# EAGLE design DuinoMite-Mini_Rev_C (EAGLE 4.16)
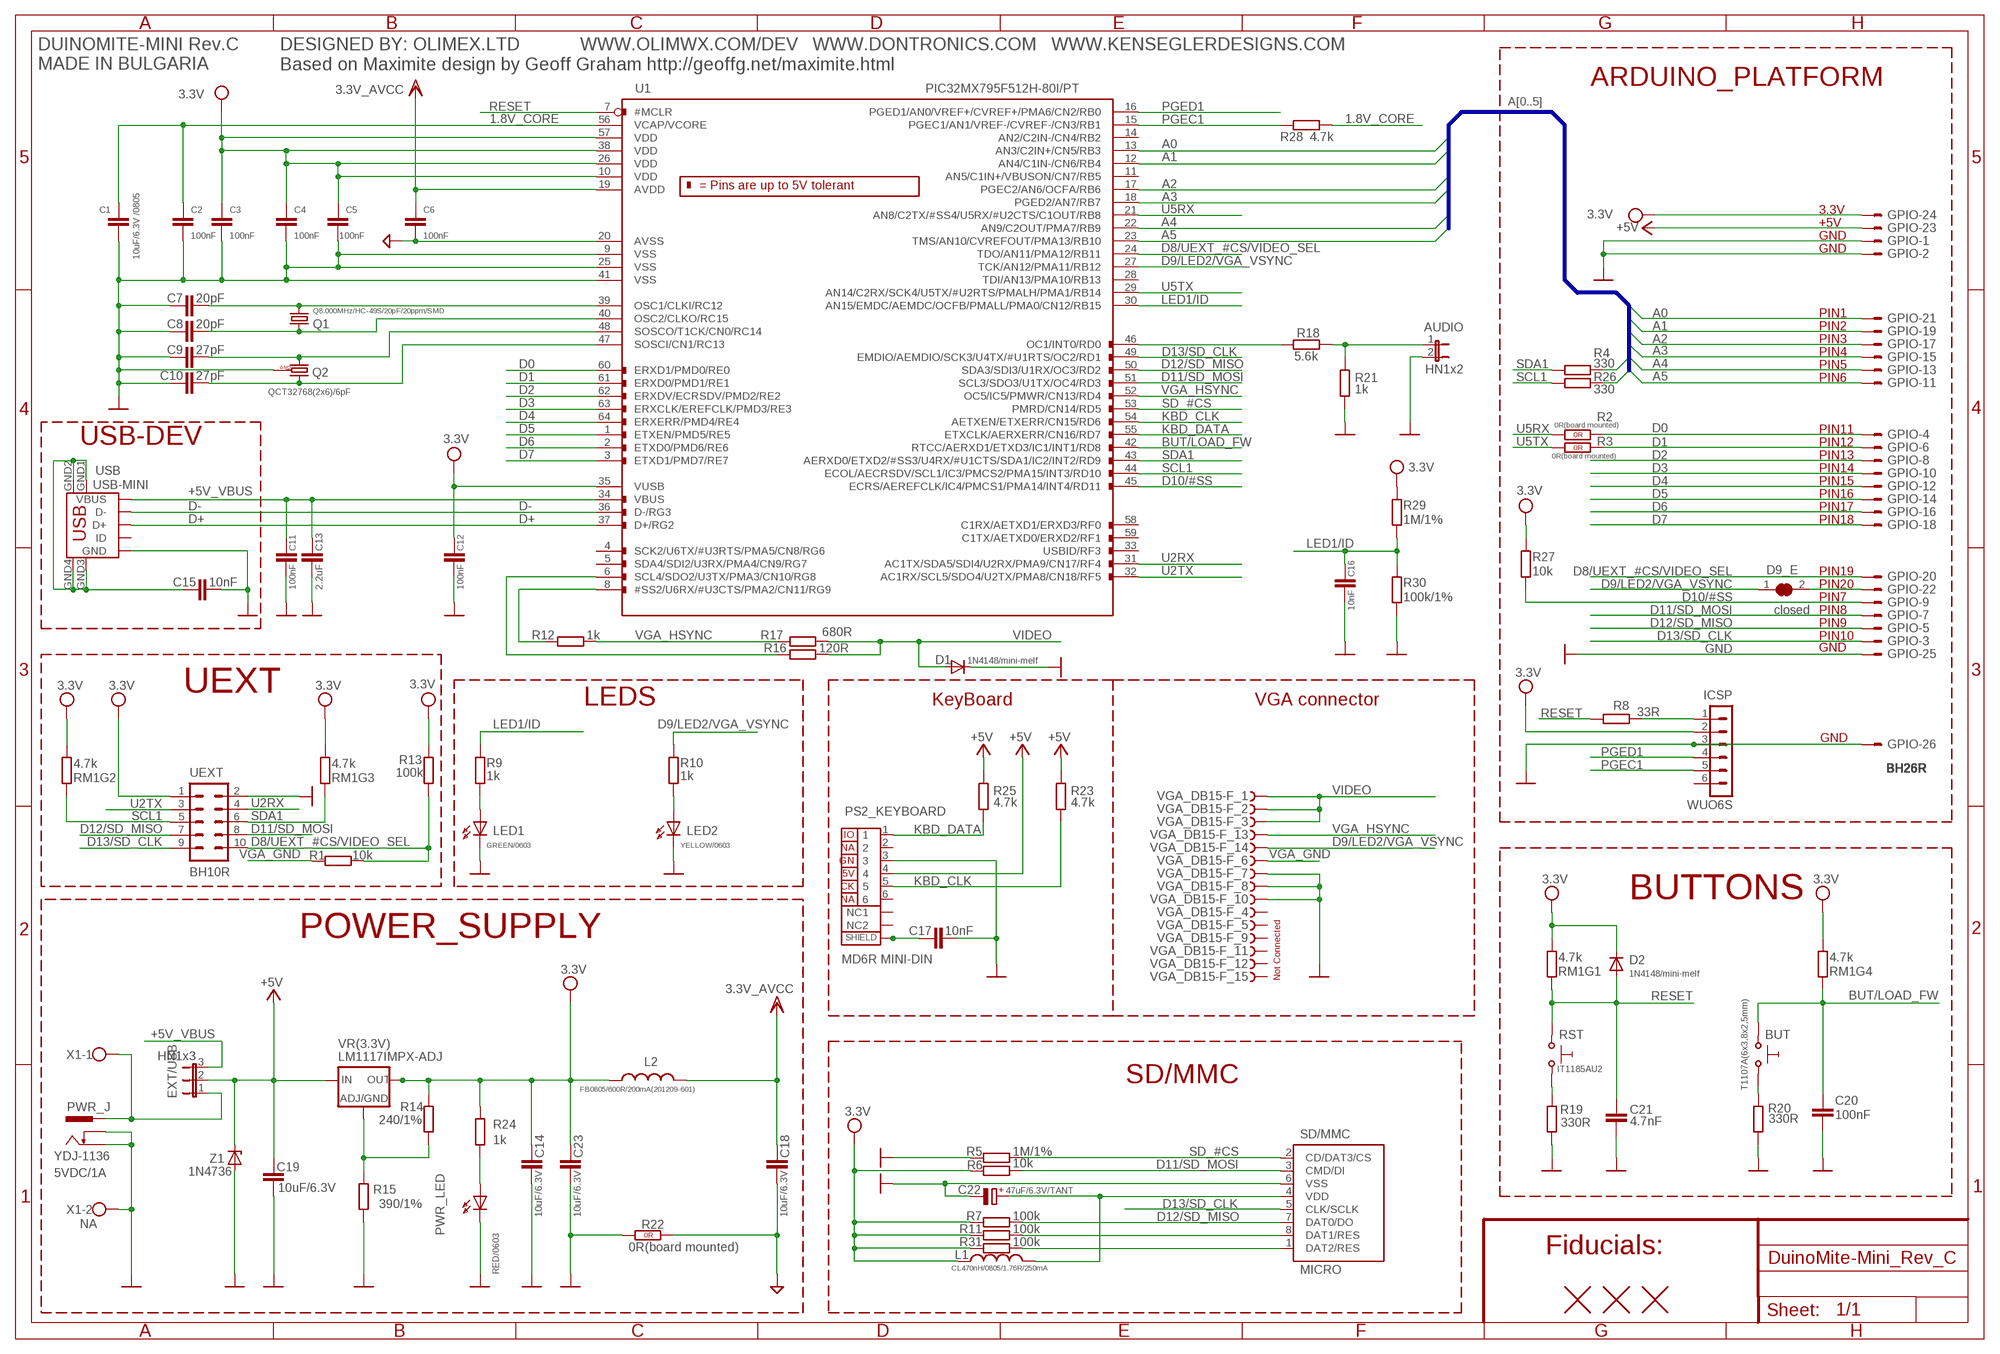
[diagram p0: schematic, sheet 1]

## Parts
AUDIO  HN1x2  JP1E  [JP1]
BUT  T1107A(6x3,8x2,5mm)  SW-TAKTT1107A(6X3,8X2,5MM)  [WS-TAKT_6X3.5_SMD_NOCREAM]
C1  10uF/6.3V /0805  C-EUC0805_5MIL_DWS  [C0805_5MIL_DWS]
C2  100nF  C-EUC0603_DWS  [C0603_DWS]
C3  100nF  C-EUC0603_DWS  [C0603_DWS]
C4  100nF  C-EUC0603_DWS  [C0603_DWS]
C5  100nF  C-EUC0603_DWS  [C0603_DWS]
C6  100nF  C-EUC0603_DWS  [C0603_DWS]
C7  20pF  C-EUC0603_DWS  [C0603_DWS]
C8  20pF  C-EUC0603_DWS  [C0603_DWS]
C9  27pF  C-EUC0603_DWS  [C0603_DWS]
C10  27pF  C-EUC0603_DWS  [C0603_DWS]
C11  100nF  C-EUC0603_DWS  [C0603_DWS]
C12  100nF  C-EUC0603_DWS  [C0603_DWS]
C13  2.2uF  C-EUC0603_DWS  [C0603_DWS]
C14  10uF/6.3V  C-EUC0805_5MIL_DWS  [C0805_5MIL_DWS]
C15  10nF  C-EUC0603_DWS  [C0603_DWS]
C16  10nF  C-EUC0603_DWS  [C0603_DWS]
C17  10nF  C-EUC0603_DWS  [C0603_DWS]
C18  10uF/6.3V  C-EUC0805_5MIL_DWS  [C0805_5MIL_DWS]
C19  10uF/6.3V  C-EUC0805  [C0805]
C20  100nF  C-EUC0603_DWS  [C0603_DWS]
C21  4.7nF  C-EUC0603_DWS  [C0603_DWS]
C22  47uF/6.3V/TANT  CPOL-EUCT3528  [CT3528]
C23  10uF/6.3V  C-EUC0805_5MIL_DWS  [C0805_5MIL_DWS]
D1  1N4148/mini-melf  DSMD  [MINI-MELF]
D2  1N4148/mini-melf  DSMD  [MINI-MELF]
D9_E  closed  SJSJ-CLOSE  [SJ-CLOSE]
EXT/USB  HN1x3  JP2E  [JP2]
GPIO  BH26R  ML26RE  [BH26R]
ICSP  WUO6S  CON6WUO6S  [WU06S]
L1  CL470nH/0805/1.76R/250mA  L-USL0805_5MIL_DWS  [L0805_5MIL_DWS]
L2  FB0805/600R/200mA(201209-601)  L-USL0805_5MIL_DWS  [L0805_5MIL_DWS]
LED1  GREEN/0603  LED0603DWS  [LED-0603]
LED2  YELLOW/0603  LED0603DWS  [LED-0603]
PS2_KEYBOARD  MD6R MINI-DIN  PS2PS2  [PS2]
PWR_J  YDJ-1136  PWR-JAKPWR_JACK_UNI_MILLING  [PWR_JACK_UNI_MILLING]
PWR_LED  RED/0603  LED0603DWS  [LED-0603]
Q1  Q8.000MHz/HC-49S/20pF/20ppm/SMD  HC49/S1  [HC49/SMD2_THIN]
Q2  QCT32768(2x6)/6pF  Q_GND1  [TC26H_3_REPAIR_SMD]
R1  10k  R-EU_R0603_5MIL_DWS  [R0603_5MIL_DWS]
R2  0R(board mounted)  R_0R0R(NA)  [0603_0R]
R3  0R(board mounted)  R_0R0R(NA)  [0603_0R]
R4  330  R-EU_R0603_5MIL_DWS  [R0603_5MIL_DWS]
R5  1M/1%  R-EU_R0603_5MIL_DWS  [R0603_5MIL_DWS]
R6  10k  R-EU_R0603_5MIL_DWS  [R0603_5MIL_DWS]
R7  100k  R-EU_R0603_5MIL_DWS  [R0603_5MIL_DWS]
R8  33R  R-EU_R0603_5MIL_DWS  [R0603_5MIL_DWS]
R9  1k  R-EU_R0603_5MIL_DWS  [R0603_5MIL_DWS]
R10  1k  R-EU_R0603_5MIL_DWS  [R0603_5MIL_DWS]
R11  100k  R-EU_R0603_5MIL_DWS  [R0603_5MIL_DWS]
R12  1k  R-EU_R0603_5MIL_DWS  [R0603_5MIL_DWS]
R13  100k  R-EU_R0603_5MIL_DWS  [R0603_5MIL_DWS]
R14  240/1%  R-EU_R0603_5MIL  [R0603_5MIL]
R15  390/1%  R-EU_R0603_5MIL  [R0603_5MIL]
R16  120R  R-EU_R0603_5MIL_DWS  [R0603_5MIL_DWS]
R17  680R  R-EU_R0603_5MIL_DWS  [R0603_5MIL_DWS]
R18  5.6k  R-EU_R0603_5MIL_DWS  [R0603_5MIL_DWS]
R19  330R  R-EU_R0603_5MIL_DWS  [R0603_5MIL_DWS]
R20  330R  R-EU_R0603_5MIL_DWS  [R0603_5MIL_DWS]
R21  1k  R-EU_R0603_5MIL_DWS  [R0603_5MIL_DWS]
R22  0R(board mounted)  R_0R0R(NA)  [0603_0R]
R23  4.7k  R-EU_R0603_5MIL_DWS  [R0603_5MIL_DWS]
R24  1k  R-EU_R0603_5MIL_DWS  [R0603_5MIL_DWS]
R25  4.7k  R-EU_R0603_5MIL_DWS  [R0603_5MIL_DWS]
R26  330  R-EU_R0603_5MIL_DWS  [R0603_5MIL_DWS]
R27  10k  R-EU_R0603_5MIL_DWS  [R0603_5MIL_DWS]
R28  4.7k  R-EU_R0603_5MIL_DWS  [R0603_5MIL_DWS]
R29  1M/1%  R-EU_R0603_5MIL_DWS  [R0603_5MIL_DWS]
R30  100k/1%  R-EU_R0603_5MIL_DWS  [R0603_5MIL_DWS]
R31  100k  R-EU_R0603_5MIL_DWS  [R0603_5MIL_DWS]
RM1  4.7k  R_MATRIX_4E  [R_MATRIX_4]
RST  IT1185AU2  SW-TAKTIT1185AU2  [IT1185AU2]
SD/MMC  MICRO  MICRO_SD/MMC  [TFR-MEM-CON]
U1  PIC32MX795F512H-80I/PT  PIC32MX795F512HT-80I/PT  [LPTQFP64]
U$2  FIDUCIAL1X2  [FIDUCIAL-1X2]
U$3  FIDUCIAL1X2  [FIDUCIAL-1X2]
U$4  FIDUCIAL1X2  [FIDUCIAL-1X2]
UEXT  BH10R  ML10R  [BH10R]
USB  USB-MINI  MINI_USB9  [USB_MINI_9PIN]
VGA_DB15-F  DB1522  [DB15-F_22MM]
VR(3.3V)  LM1117IMPX-ADJ  LM1117THERMAL_OFF  [SOT223_]
X1  NA  W237-102  [W237-102]
Z1  1N4736  Z  [1N4742]

## Nets
1.8V_CORE: C1.1 C2.1 R28.1 U1.56(VCAP/VCORE)
+5V: C19.1 EXT/USB.2 GPIO.23 PS2_KEYBOARD.4 R23.1 R25.1 VR(3.3V).3(IN) Z1.K
+5V_VBUS [pwr]: C11.2 C13.1 EXT/USB.3 U1.34(VBUS) USB.VBUS
A0: GPIO.21 U1.13(AN3/C2IN+/CN5/RB3)
A1: GPIO.19 U1.12(AN4/C1IN-/CN6/RB4)
A2: GPIO.17 U1.17(PGEC2/AN6/OCFA/RB6)
A3: GPIO.15 U1.18(PGED2/AN7/RB7)
A4: GPIO.13 R4.1 U1.22(AN9/C2OUT/PMA7/RB9)
A5: GPIO.11 R26.1 U1.23(TMS/AN10/CVREFOUT/PMA13/RB10)
AGND: C6.2 C18.2 R22.2(1.2) U1.20(AVSS)
BUT/LOAD_FW: BUT.P$1 C20.1 RM1.4.2 U1.42(RTCC/AERXD1/ETXD3/IC1/INT1/RD8)
D0: GPIO.4 R2.2(1.2) U1.60(ERXD1/PMD0/RE0)
D1: GPIO.6 R3.2(1.2) U1.61(ERXD0/PMD1/RE1)
D2: GPIO.8 U1.62(ERXDV/ECRSDV/PMD2/RE2)
D3: GPIO.10 U1.63(ERXCLK/EREFCLK/PMD3/RE3)
D4: GPIO.12 U1.64(ERXERR/PMD4/RE4)
D5: GPIO.14 U1.1(ETXEN/PMD5/RE5)
D6: GPIO.16 U1.2(ETXD0/PMD6/RE6)
D7: GPIO.18 U1.3(ETXD1/PMD7/RE7)
D8/UEXT_#CS/VIDEO_SEL: GPIO.20 R1.1 R13.1 U1.24(TDO/AN11/PMA12/RB11) UEXT.10
D9/LED2/VGA_VSYNC: D9_E.1 R10.2 U1.27(TCK/AN12/PMA11/RB12) VGA_DB15-F.14
D10/#SS: GPIO.9 R27.1 U1.45(ECRS/AEREFCLK/IC4/PMCS1/PMA14/INT4/RD11)
D11/SD_MOSI: GPIO.7 R6.1 SD/MMC.3(CMD/DI) U1.51(SCL3/SDO3/U1TX/OC4/RD3) UEXT.8
D12/SD_MISO: GPIO.5 R7.1 SD/MMC.7(DAT0/DO) U1.50(SDA3/SDI3/U1RX/OC3/RD2) UEXT.7
D13/SD_CLK: GPIO.3 SD/MMC.5(CLK/SCLK) U1.49(EMDIO/AEMDIO/SCK3/U4TX/#U1RTS/OC2/RD1) UEXT.9
D+: U1.37(D+/RG2) USB.D+
D-: U1.36(D-/RG3) USB.D-
GND [pwr]: AUDIO.2 C1.2 C2.2 C3.2 C4.2 C5.2 C7.1 C8.1 C9.1 C10.1 C11.1 C12.1 C13.2 C14.2 C15.1 C16.1 C17.2 C19.2 C20.2 C21.2 C22.- C23.2 D1.C(K) GPIO.1 GPIO.2 GPIO.25 GPIO.26 ICSP.3 LED1.C LED2.C PS2_KEYBOARD.3 PWR_J.- PWR_J.-- PWR_LED.C Q2.GND R5.2 R15.1 R19.1 R20.1 R21.2 R22.1(1.1) R30.1 SD/MMC.6(VSS) U1.9(VSS) U1.25(VSS) U1.41(VSS) UEXT.2 USB.GND VGA_DB15-F.7 VGA_DB15-F.8 VGA_DB15-F.10 X1.2 Z1.A
KBD_CLK: PS2_KEYBOARD.5 R23.2 U1.54(AETXEN/ETXERR/CN15/RD6)
KBD_DATA: PS2_KEYBOARD.1 R25.2 U1.55(ETXCLK/AERXERR/CN16/RD7)
LED1/ID: C16.2 R9.2 R29.1 R30.2 U1.30(AN15/EMDC/AEMDC/OCFB/PMALL/PMA0/CN12/RB15)
MCIDAT1: R11.1 SD/MMC.8(DAT1/RES)
MCIDAT2: R31.1 SD/MMC.1(DAT2/RES)
N$1: D9_E.2 GPIO.22
N$2: C9.2 Q2.1 U1.48(SOSCO/T1CK/CN0/RC14)
N$3: R18.2 U1.46(OC1/INT0/RD0)
N$4: ICSP.1 R8.1
N$5: LED2.A R10.1
N$6: AUDIO.1 R18.1 R21.1
N$8: PWR_LED.A R24.2
N$11 [pwr]: R19.2 RST.2
N$12 [pwr]: BUT.P$2 R20.2
N$13: EXT/USB.1 PWR_J.+ X1.1
N$17: C7.2 Q1.2 U1.39(OSC1/CLKI/RC12)
N$18: R16.1 U1.6(SCL4/SDO2/U3TX/PMA3/CN10/RG8)
N$19: C8.2 Q1.1 U1.40(OSC2/CLKO/RC15)
N$23: LED1.A R9.1
N$24: R12.1 U1.8(#SS2/U6RX/#U3CTS/PMA2/CN11/RG9)
N$28: C10.2 Q2.2 U1.47(SOSCI/CN1/RC13)
N$39: R14.1 R15.2 VR(3.3V).1(ADJ/GND)
N$86: C17.1 PS2_KEYBOARD.SHIELD1 PS2_KEYBOARD.SHIELD2 PS2_KEYBOARD.SHIELD3
N$116: C22.+ L1.2 SD/MMC.4(VDD)
PGEC1: ICSP.5 R28.2 U1.15(PGEC1/AN1/VREF-/CVREF-/CN3/RB1)
PGED1: ICSP.4 U1.16(PGED1/AN0/VREF+/CVREF+/PMA6/CN2/RB0)
RESET: C21.1 D2.A R8.2 RM1.1.2 RST.1 U1.7(#MCLR)
SCL1: R26.2 RM1.2.2 U1.44(ECOL/AECRSDV/SCL1/IC3/PMCS2/PMA15/INT3/RD10) UEXT.5
SD_#CS: R5.1 SD/MMC.2(CD/DAT3/CS) U1.53(PMRD/CN14/RD5)
SDA1: R4.2 RM1.3.2 U1.43(AERXD0/ETXD2/#SS3/U4RX/#U1CTS/SDA1/IC2/INT2/RD9) UEXT.6
U2RX: U1.31(AC1TX/SDA5/SDI4/U2RX/PMA9/CN17/RF4) UEXT.4
U2TX: U1.32(AC1RX/SCL5/SDO4/U2TX/PMA8/CN18/RF5) UEXT.3
U5RX: R2.1(1.1) U1.21(AN8/C2TX/#SS4/U5RX/#U2CTS/C1OUT/RB8)
U5TX: R3.1(1.1) U1.29(AN14/C2RX/SCK4/U5TX/#U2RTS/PMALH/PMA1/RB14)
USB_SHIELD: C15.2 USB.GND1 USB.GND2 USB.GND3 USB.GND4
VCC: C3.1 C4.1 C5.1 C12.2 C14.1 C23.1 D2.C(K) GPIO.24 ICSP.2 L1.1 L2.1 R6.2 R7.2 R11.2 R13.2 R14.2 R24.1 R27.2 R29.2 R31.2 RM1.1.1 RM1.2.1 RM1.3.1 RM1.4.1 U1.10(VDD) U1.26(VDD) U1.35(VUSB) U1.38(VDD) U1.57(VDD) UEXT.1 VR(3.3V).2(OUT) VR(3.3V).4(RAD) ; supply symbol labelled 3.3V
VDD: C6.1 C18.1 L2.2 U1.19(AVDD) ; supply symbol labelled 3.3V_AVCC
VGA_GND: R1.2 VGA_DB15-F.6
VGA_HSYNC: R12.2 R17.1 U1.52(OC5/IC5/PMWR/CN13/RD4) VGA_DB15-F.13
VIDEO: D1.A R16.2 R17.2 VGA_DB15-F.1 VGA_DB15-F.2 VGA_DB15-F.3
Unconnected: ICSP.6 PS2_KEYBOARD.2 PS2_KEYBOARD.6 PS2_KEYBOARD.NC1 PS2_KEYBOARD.NC2 U1.4(SCK2/U6TX/#U3RTS/PMA5/CN8/RG6) U1.5(SDA4/SDI2/U3RX/PMA4/CN9/RG7) U1.11(AN5/C1IN+/VBUSON/CN7/RB5) U1.14(AN2/C2IN-/CN4/RB2) U1.28(TDI/AN13/PMA10/RB13) U1.33(USBID/RF3) U1.58(C1RX/AETXD1/ERXD3/RF0) U1.59(C1TX/AETXD0/ERXD2/RF1) USB.ID VGA_DB15-F.4 VGA_DB15-F.5 VGA_DB15-F.9 VGA_DB15-F.11 VGA_DB15-F.12 VGA_DB15-F.15

## Buses
A[0..5]

## Notes on the sheet
- DUINOMITE-MINI Rev.C | DESIGNED BY: OLIMEX.LTD | WWW.OLIMWX.COM/DEV | WWW.DONTRONICS.COM | WWW.KENSEGLERDESIGNS.COM
- MADE IN BULGARIA | Based on Maximite design by Geoff Graham http://geoffg.net/maximite.html
- ARDUINO_PLATFORM
- 3.3V
- +5V
- GND
- GND
- PIN1
- PIN2
- PIN3
- PIN4
- PIN5
- PIN6
- PIN11
- USB-DEV | PIN12
- PIN13
- PIN14
- PIN15
- PIN16
- PIN17
- PIN18
- PIN19
- PIN20
- PIN7
- PIN8
- PIN9
- PIN10
- GND
- UEXT
- LEDS | KeyBoard | VGA connector
- GND
- BUTTONS
- POWER_SUPPLY
- Not Connected
- SD/MMC
- 5VDC/1A
- Fiducials:

## Power pins joined to a net without a drawn wire
GND: VGA_DB15-F.GND1 VGA_DB15-F.GND2

## Library data of the parts
AUDIO = jumper:JP1E: JUMPER
BUT RST = gogo:SW-TAKT
C1-C21 C23 = rcl:C-EU: CAPACITOR, European symbol
C22 = rcl:CPOL-EU: POLARIZED CAPACITOR, European symbol
D1 D2 = DOUBLE-SIDE:D: DIODES
D9_E = jumper:SJ: SMD solder JUMPER
EXT/USB = jumper:JP2E: JUMPER
GPIO = con-harting-ml:ML26?E: HARTING
ICSP = Penko:CON6: CONNECTORS - 6 PINS
L1 L2 = rcl:L-US: INDUCTOR, American symbol
LED1 LED2 PWR_LED = DOUBLE-SIDE:LED
PS2_KEYBOARD = OLIMEX_CONNECTORS:PS2
PWR_J = gogo:PWR-JAK
Q1 = crystal:HC49/S: CRYSTAL
Q2 = crystal:Q_GND
R1 R4-R21 R23-R31 = rcl:R-EU_: RESISTOR, European symbol
R2 R3 R22 = OLIMEX_DISCRET:R_0R
RM1 = OLIMEX_DISCRET:R_MATRIX_4E
SD/MMC = OLIMEX_CONNECTORS:MICRO_SD/MMC
U1 = OLIMEX_IC:PIC32MX795F512H
U$2-U$4 = SparkFunEagle-6-6-07:FIDUCIAL: Fiducial Alignment Points Various fiducial points for machine vision alignment.
UEXT = con-harting-ml:ML10: HARTING
USB = OLIMEX_CONNECTORS:MINI_USB9
VGA_DB15-F = OLIMEX_CONNECTORS:DB15
VR(3.3V) = arm:LM1117
X1 = con-wago-500:W237-102: WAGO SCREW CLAMP
Z1 = DOUBLE-SIDE:Z: ZENER

## Net classes
1 pwr: width 0.508 mm, drill 0.241 mm

## Board
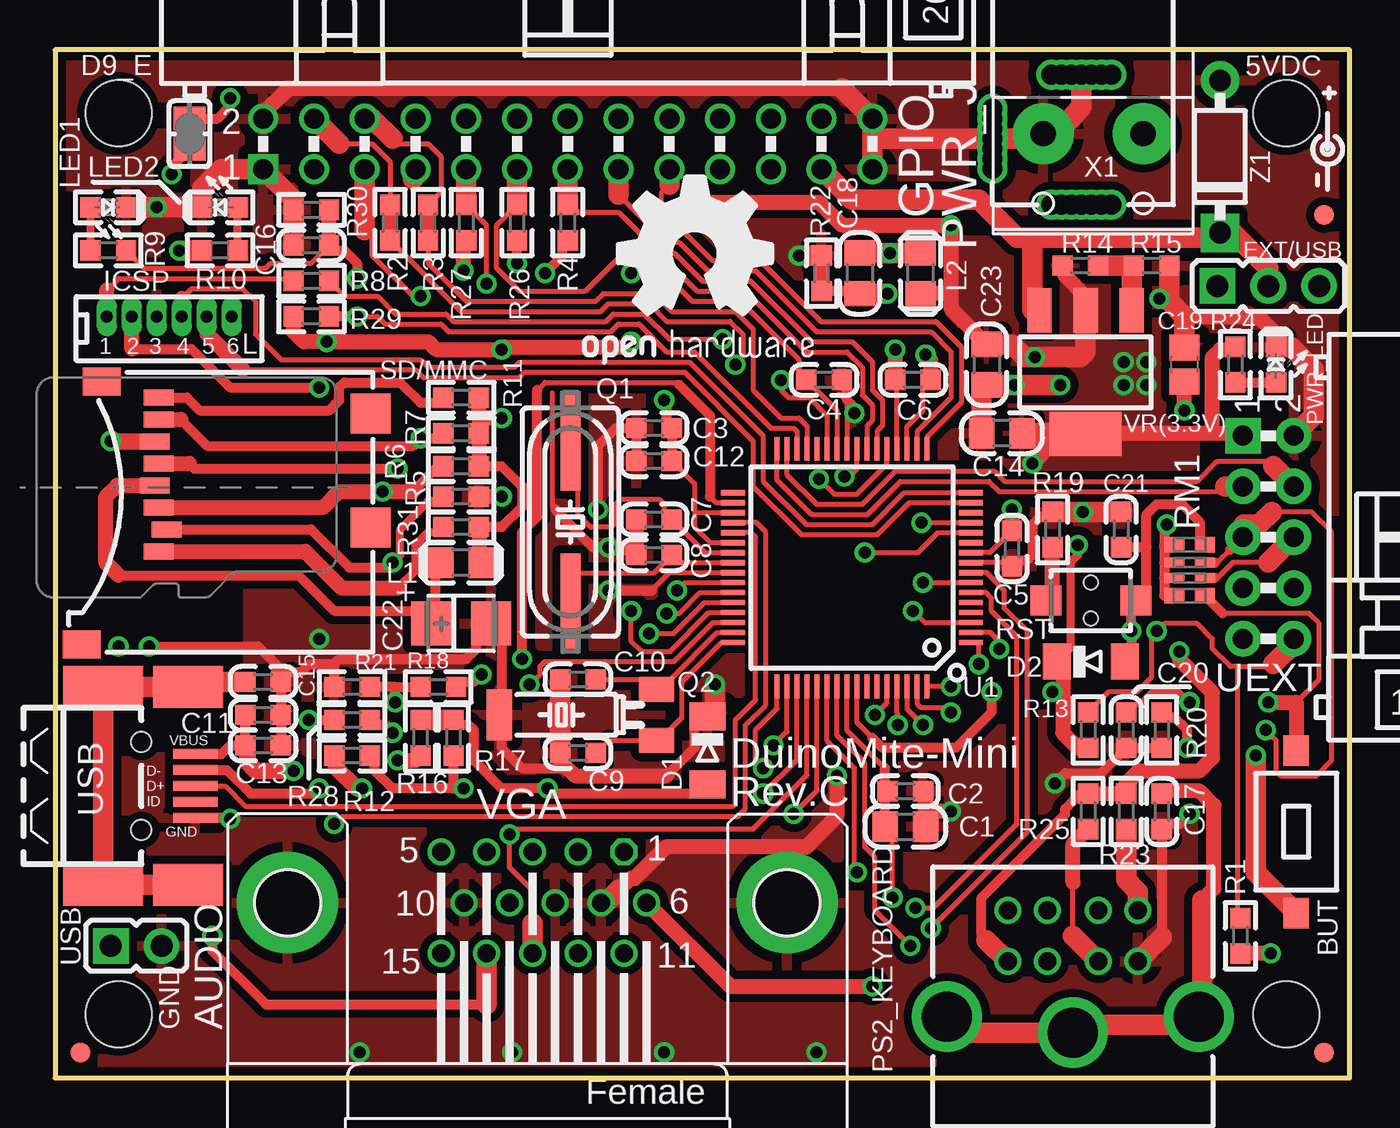
[diagram p1: board, top side]
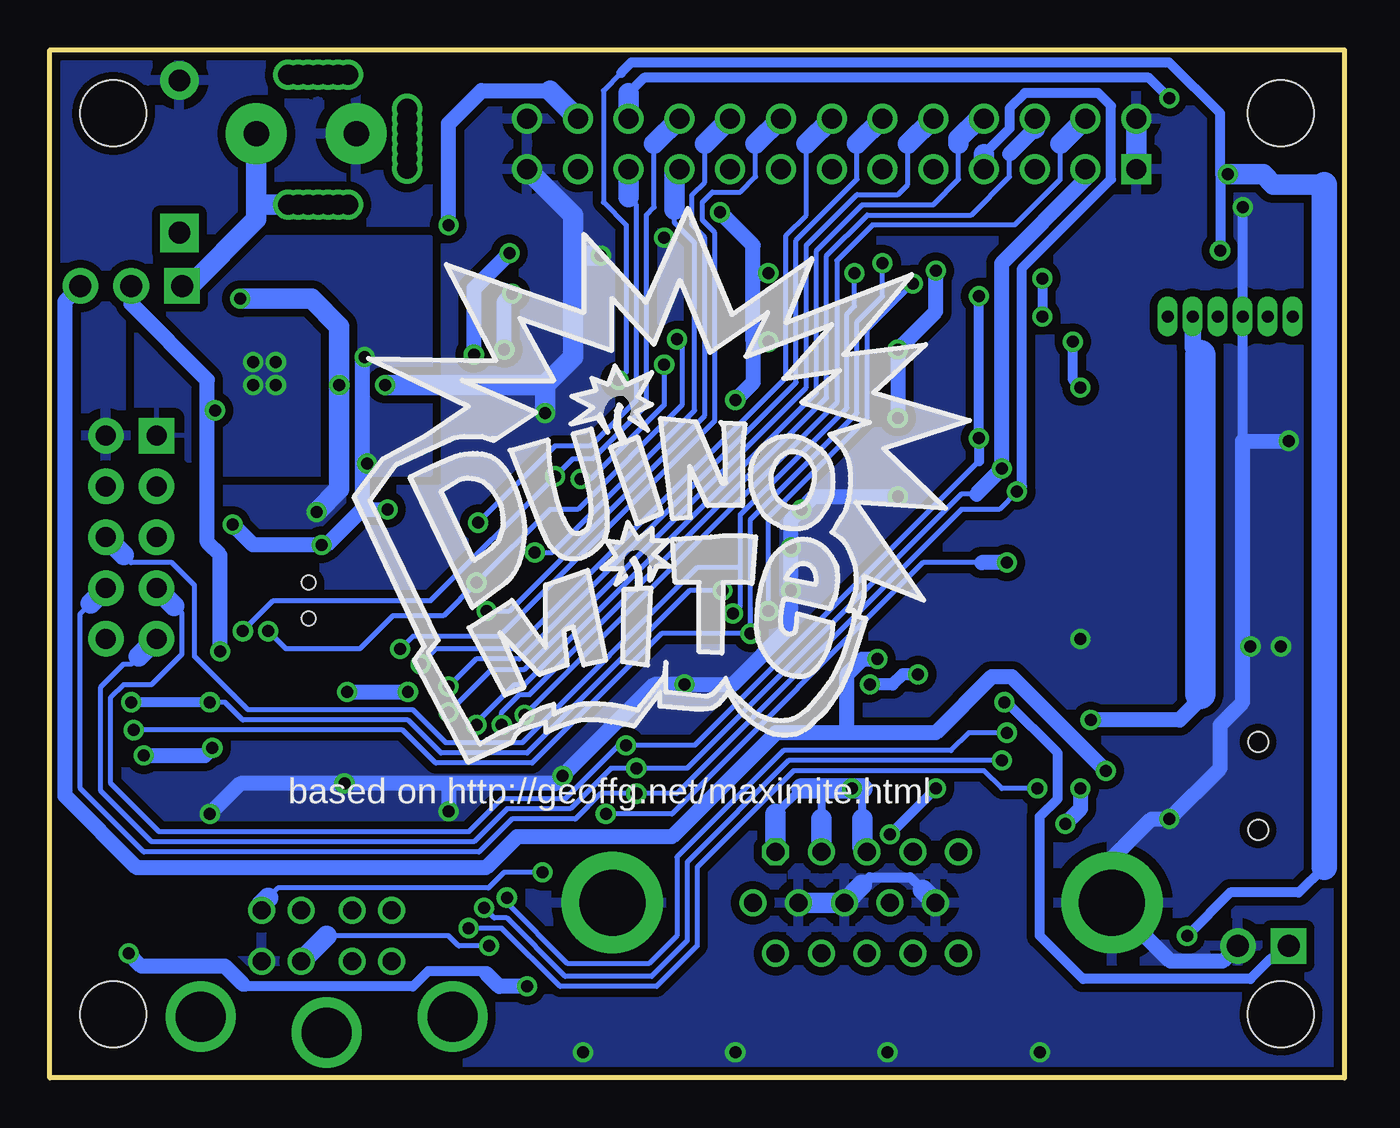
[diagram p2: board, bottom side, seen from below]

Size 64.77 x 51.44 mm. Coordinates in mm from the lower left corner, seen from the top.
Outline: 0,0 64.77,0 64.77,51.44 0,51.44 0,0
Copper layers (1+16): Top 0.035mm / dielectric 1.5mm / Bottom 0.035mm
Design rules "default": minimum track width 10mil, minimum drill 0.6mm, track to track 9.5mil, track to pad 9.5mil, pad to pad 9.5mil, via to via 9.5mil, smd to smd 1mil, copper to edge 10mil, drill to drill 8mil, minimum pad ring 8mil, minimum via ring 8mil, stop-mask expansion 4mil, vias tented up to drill 25mil, thermal gap 20mil
Holes 3.3 mm at 3.17,3.17 3.17,48.26 61.59,48.26 61.59,3.17

### Footprints (pad centres in the part's own frame; a part is rotated, then mirrored left to right if it is on the bottom)
JP1 = drill 1.1 pad 1.778 square: 1 0,-1.27 | drill 1.1 pad 1.778 round: 2 0,1.27
WS-TAKT_6X3.5_SMD_NOCREAM = smd 1.27 x 1.524: P$1 0,4.064; P$2 0,-4.064
C0805_5MIL_DWS = smd 1.27 x 1.524: 1 -1.016,0; 2 1.016,0
C0603_DWS = smd 1.016 x 1.016: 1 -0.889,0; 2 0.889,0
C0805 = smd 1.3 x 1.5: 1 -0.85,0; 2 0.85,0
CT3528 = smd 2 x 2.2: + -1.5,0; - 1.5,0
MINI-MELF = smd 1.4 x 1.8: A 1.7,0; C -1.7,0
SJ-CLOSE = smd 1.168 x 1.6: 1 -0.762,0; 2 0.762,0
JP2 = drill 1.1 pad 1.778 square: 1 -2.54,0 | drill 1.1 pad 1.778 round: 2 0,0; 3 2.54,0
BH26R = drill 1 square: 1 -15.24,-1.27 | drill 1 round: 2 -15.24,1.27; 3 -12.7,-1.27; 4 -12.7,1.27; 5 -10.16,-1.27; 6 -10.16,1.27; 7 -7.62,-1.27; 8 -7.62,1.27; 9 -5.08,-1.27; 10 -5.08,1.27; 11 -2.54,-1.27; 12 -2.54,1.27; 13 0,-1.27; 14 0,1.27; 15 2.54,-1.27; 16 2.54,1.27; 17 5.08,-1.27; 18 5.08,1.27; 19 7.62,-1.27; 20 7.62,1.27; 21 10.16,-1.27; 22 10.16,1.27; 23 12.7,-1.27; 24 12.7,1.27; 25 15.24,-1.27; 26 15.24,1.27
WU06S = drill 0.6 pad 0.991 long: 1 -3.125,0; 2 -1.875,0; 3 -0.625,0; 4 0.625,0; 5 1.875,0; 6 3.125,0
L0805_5MIL_DWS = smd 1.27 x 1.524: 1 -1.016,0; 2 1.016,0
LED-0603 = smd 1.016 x 1.016: A 0.889,0; C -0.889,0
PS2 = drill 0.9 round: 1 1.27,1.77; 2 -1.27,1.77; 3 3.26,1.77; 4 -3.26,1.77; 5 3.26,4.31; 6 -3.26,4.31; NC1 -1.27,4.31; NC2 1.27,4.31 | drill 2.5 round: SHIELD1 -6.3,-1; SHIELD2 0,-1.8; SHIELD3 6.3,-1
PWR_JACK_UNI_MILLING = drill 1 round: + 0,4.75; +1 0,5.25; +2 0,5.75; +3 0,6.25; +4 0,4.25; +5 0,3.75; +6 0,3.25; - -6.5,4.75; -1 -6.5,5.25; -2 -6.5,5.75; -3 -6.5,4.25; -4 -6.5,3.75; -5 -6.5,6.25; -6 -6.5,3.25; -- -3.3,0.3; --1 -3.8,0.3; --2 -4.3,0.3; --3 -4.8,0.3; --4 -2.8,0.3; --5 -2.3,0.3; --6 -1.8,0.3
HC49/SMD2_THIN = smd 5 x 1: 1 -4.064,0; 2 4.064,0
TC26H_3_REPAIR_SMD = smd 1.27 x 1.778: 1 -1.27,0; 2 1.27,0 | smd 2.54 x 1.27: GND 0,7.874
R0603_5MIL_DWS = smd 1.016 x 1.016: 1 -0.889,0; 2 0.889,0
0603_0R = smd 1.016 x 1.016: 1 -0.889,0; 2 0.889,0
R0603_5MIL = smd 1.016 x 1.016: 1 -0.889,0; 2 0.889,0
R_MATRIX_4 = smd 1.016 x 0.762: 1.1 -0.762,1.27; 1.2 0.762,1.27; 4.1 -0.762,-1.27; 4.2 0.762,-1.27 | smd 1.016 x 0.508: 2.1 -0.762,0.381; 2.2 0.762,0.381; 3.1 -0.762,-0.381; 3.2 0.762,-0.381
IT1185AU2 = smd 1.55 x 1.5: 1 -2.25,0; 2 2.25,0 | hole 0.7: 0,-0.9; 0,0.9
TFR-MEM-CON = smd 0.8 x 1.5: 1 -3.2,10.7; 2 -2.1,10.3; 3 -1,10.7; 4 0.1,10.9; 5 1.2,10.7; 6 2.3,10.9; 7 3.4,10.7; 8 4.5,10.7 | smd 2 x 2: 9 3.7,0.1; 10 -2,0.1 | smd 1.4 x 1.9: 11 5.3,13.55; 12 -7.85,14.55
LPTQFP64 = smd 1.2 x 0.254: 1 -5.95,3.75; 2 -5.95,3.25; 3 -5.95,2.75; 4 -5.95,2.25; 5 -5.95,1.75; 6 -5.95,1.25; 7 -5.95,0.75; 8 -5.95,0.25; 9 -5.95,-0.25; 10 -5.95,-0.75; 11 -5.95,-1.25; 12 -5.95,-1.75; 13 -5.95,-2.25; 14 -5.95,-2.75; 15 -5.95,-3.25; 16 -5.95,-3.75; 33 5.95,-3.75; 34 5.95,-3.25; 35 5.95,-2.75; 36 5.95,-2.25; 37 5.95,-1.75; 38 5.95,-1.25; 39 5.95,-0.75; 40 5.95,-0.25; 41 5.95,0.25; 42 5.95,0.75; 43 5.95,1.25; 44 5.95,1.75; 45 5.95,2.25; 46 5.95,2.75; 47 5.95,3.25; 48 5.95,3.75 | smd 0.254 x 1.2: 17 -3.75,-5.95; 18 -3.25,-5.95; 19 -2.75,-5.95; 20 -2.25,-5.95; 21 -1.75,-5.95; 22 -1.25,-5.95; 23 -0.75,-5.95; 24 -0.25,-5.95; 25 0.25,-5.95; 26 0.75,-5.95; 27 1.25,-5.95; 28 1.75,-5.95; 29 2.25,-5.95; 30 2.75,-5.95; 31 3.25,-5.95; 32 3.75,-5.95; 49 3.75,5.95; 50 3.25,5.95; 51 2.75,5.95; 52 2.25,5.95; 53 1.75,5.95; 54 1.25,5.95; 55 0.75,5.95; 56 0.25,5.95; 57 -0.25,5.95; 58 -0.75,5.95; 59 -1.25,5.95; 60 -1.75,5.95; 61 -2.25,5.95; 62 -2.75,5.95; 63 -3.25,5.95; 64 -3.75,5.95
FIDUCIAL-1X2 = smd 1 x 1: 1 0,0
BH10R = drill 1 pad 1.778 square: 1 -5.08,-1.27 | drill 1 pad 1.778 round: 2 -5.08,1.27; 3 -2.54,-1.27; 4 -2.54,1.27; 5 0,-1.27; 6 0,1.27; 7 2.54,-1.27; 8 2.54,1.27; 9 5.08,-1.27; 10 5.08,1.27
USB_MINI_9PIN = smd 2.25 x 0.5: D+ 2.706,0; D- 2.706,0.8; GND 2.706,-1.6; ID 2.706,-0.8; VBUS 2.706,1.6 | smd 4 x 2.1: GND1 -1.9,4.95; GND3 -1.9,-4.95 | smd 3.5 x 2.1: GND2 2.35,4.95; GND4 2.35,-4.95 | hole 1: 0,2.2; 0,-2.2
DB15-F_22MM = drill 0.9 octagon: 1 4.329,6.35 | drill 0.9 round: 2 2.043,6.35; 3 -0.243,6.35; 4 -2.529,6.35; 5 -4.815,6.35; 6 5.472,3.81; 7 3.186,3.81; 8 0.9,3.81; 9 -1.386,3.81; 10 -3.672,3.81; 11 4.329,1.27; 12 2.043,1.27; 13 -0.243,1.27; 14 -2.529,1.27; 15 -4.815,1.27 | drill 3.302 pad 5.08 round: GND1 -12.497,3.81; GND2 12.497,3.81
SOT223_ = smd 1.219 x 2.235: 1 -2.311,-3.099; 2 0,-3.099; 3 2.311,-3.099 | smd 3.6 x 2.2: 4 0,3.099
W237-102 = drill 1.27 pad 3.048 round: 1 -2.5,-1.27; 2 2.5,-1.27
1N4742 = drill 1.092 pad 1.93 round: A 3.81,0 | drill 1.092 pad 1.93 square: K -3.81,0

### Placement (x,y rotation side)
AUDIO  4.06,6.6 270 top
BUT  62.1,12.32 0 top
C1  42.55,12.57 0 top
C2  42.55,14.35 0 top
C3  29.97,32.51 180 top
C4  38.48,34.92 0 top
C5  47.88,26.49 270 top
C6  42.93,34.92 180 top
C7  29.97,27.94 0 top
C8  29.97,26.16 0 top
C9  26.16,16.26 0 top
C10  26.16,19.94 0 top
C11  10.41,18.16 180 top
C12  29.97,30.86 0 top
C13  10.41,16.64 0 top
C14  47.37,32.26 180 top
C15  10.41,19.81 180 top
C16  12.83,41.66 0 top
C17  55.37,13.34 270 top
C18  40.26,40.26 270 top
C19  56.52,35.69 90 top
C20  53.59,17.4 270 top
C21  53.34,27.43 90 top
C22  20.32,22.73 0 top
C23  46.61,35.69 270 top
D1  32.64,16.38 270 top
D2  51.82,20.83 0 top
D9_E  6.73,47.24 90 top
EXT/USB  60.71,39.62 0 top
GPIO  25.65,46.74 0 top
ICSP  5.71,38.1 0 top
L1  20.32,25.78 180 top
L2  43.31,40.26 90 top
LED1  2.67,43.56 180 top
LED2  8.26,43.56 0 top
PS2_KEYBOARD  50.93,4.06 0 top
PWR_J  46.61,43.69 270 top
PWR_LED  61.09,35.69 270 top
Q1  25.78,27.81 90 top
Q2  30.1,18.16 90 top
R1  59.31,7.11 270 top
R2  16.76,42.8 90 top
R3  18.67,42.8 90 top
R4  25.65,42.8 270 top
R5  20.32,29.08 0 top
R6  20.32,30.61 0 top
R7  20.32,32.26 0 top
R8  12.83,39.88 0 top
R9  2.67,41.4 0 top
R10  8.26,41.4 180 top
R11  20.32,34.04 0 top
R12  14.86,16.13 0 top
R13  51.69,17.4 270 top
R14  51.31,40.64 180 top
R15  54.86,40.64 180 top
R16  18.29,17.02 90 top
R17  19.94,17.02 90 top
R18  19.18,19.56 0 top
R19  49.91,27.43 270 top
R20  55.37,17.4 90 top
R21  14.86,19.56 180 top
R22  38.35,40.26 270 top
R23  53.59,13.34 270 top
R24  59.05,35.69 270 top
R25  51.69,13.34 270 top
R26  23.11,42.8 270 top
R27  20.57,42.8 270 top
R28  14.86,17.91 180 top
R29  12.83,38.1 180 top
R30  12.83,43.43 0 top
R31  20.32,27.56 0 top
RM1  56.77,25.4 0 top
RST  51.82,23.88 180 top
SD/MMC  15.89,29.55 90 top
U1  39.88,25.53 180 top
U$1  [PB_SMAL_STOP]  9.07,42.16 270 bottom
U$2  1.27,1.27 90 top
U$3  63.5,1.27 90 top
U$4  63.5,43.18 90 top
U$5  [RECYCLE_BIN1/8_TOPSTOP]  5.44,11.3 90 bottom
U$7  [OLIMEX1_V_T_STOP]  13.56,0.61 0 bottom
U$8  [DUINOMITE1]  49.15,15.49 0 bottom
U$9  [ESD_STOP]  12.95,19.18 90 bottom
U$10  [LOGO-OPENHARDWARE_8X8]  32,41.15 0 top
UEXT  60.71,27.05 270 top
USB  4.32,14.61 0 top
VGA_DB15-F  24.13,4.95 0 top
VR(3.3V)  51.56,35.31 180 top
X1  51.94,45.97 180 top
Z1  58.29,46.1 90 top

### Tracks (layer width: path | path; a pad name or v marks a point on that pad's centre or on a via)
1.8V_CORE  (via drill 0.6)
  Top 0.254: U1.56 39.63,17.39 41.53,15.49 | v41.91,9.02 41.91,12.19 C1.1
  Top 0.508: C1.1 41.53,14.35 | 41.53,14.35 C2.1 | 41.53,14.35 41.53,15.49 | R28.1 16,17.65 16.51,17.65 v16.89,17.27
  Bottom 0.254: v16.89,17.27 18.8,17.27 19.68,16.38 28.07,16.38 33.4,11.05 33.4,7.11 34.8,5.71 38.86,5.71 41.91,8.76 v41.91,9.02
+5V  (via drill 0.6)
  Top 0.508: R25.1 51.31,14.22 50.55,13.46 50.55,13.21 46.35,9.02 46.35,7.15 46.61,6.89
  Top 0.762: R25.1 R23.1 53.59,14.73 54.23,15.37 57.28,15.37 57.91,16 57.91,19.28 56.26,20.93 v56.26,21.34 | v56.52,33.4 C19.1
  Top 1.016: PS2_KEYBOARD.4 46.61,6.89 | GPIO.23 39.88,43.94 46.23,43.94 48.13,42.04 48.9,42.04 | 48.9,42.04 48.9,38.41 VR(3.3V).3 | 48.9,42.04 58.04,42.04 Z1.K 58.93,42.29 60.71,40.51 EXT/USB.2
  Bottom 0.762: v56.26,21.34 56.26,26.16 56.9,26.8 56.9,33.4 | EXT/USB.2 60.71,38.73 56.9,34.92 56.9,33.4 | 56.9,33.4 v56.52,33.4
+5V_VBUS  (via drill 0.6)
  Top 0.254: 32.77,29.08 33.07,28.78 U1.34 | 31.24,34.67 31.11,34.8 24.51,34.8 24.13,34.42
  Top 0.508: 9.53,17.53 C13.1 8.76,16.64 8.33,16.2 USB.VBUS | 9.53,17.53 C11.2 | 31.24,34.67 32.77,33.15 32.77,29.08 | v23.37,20.95 23.37,27.3 24.13,28.07 24.13,34.42 | 9.53,17.53 9.53,17.65
  Top 0.813: C13.1 9.63,16.54 9.63,15.77 10.03,15.37 v11.94,15.37
  Bottom 0.762: v23.37,20.95 24.13,20.95 24.89,20.19 24.89,17.27 | v11.94,15.37 16.64,20.07 17.65,20.07 20.45,17.27 24.89,17.27 | 24.89,17.27 28.45,17.27 33.66,12.06 41.4,12.06 42.95,10.52 60.43,10.52 64.01,14.1 64.01,38.86 EXT/USB.3
A0  (via drill 0.6)
  Top 0.254: v43.34,27.78 U1.13
  Bottom 0.254: 35.81,44.07 35.43,43.69 35.43,33.91 37.72,31.62 39.5,31.62 v43.34,27.78
  Bottom 1.016: 35.81,44.07 GPIO.21
A1  (via drill 0.6)
  Top 0.254: v40.51,26.29 43.18,26.29 44.17,27.28 U1.12
  Bottom 0.254: v40.51,26.29 39.62,26.29 32.51,33.4 32.51,41.78 33.53,42.8 33.53,43.43
  Bottom 1.016: 33.53,43.43 33.53,45.21 GPIO.19
A2
  Top 0.254: U1.17 43.63,32.07 45.34,33.78 45.34,36.58 44.07,37.85 38.33,37.85 35.28,40.89 32.89,40.89 31.5,42.29 30.86,42.29 30.35,42.8 30.35,44.32 30.73,44.7
  Top 1.016: 30.73,44.7 GPIO.17
A3
  Top 0.254: U1.18 43.13,32.33 44.83,34.04 44.83,36.32 43.81,37.34 38.1,37.34 35.05,40.39 32.64,40.39 31.24,41.78 30.61,41.78 28.19,44.2
  Top 1.016: 28.19,44.2 GPIO.15
A4
  Top 0.254: U1.22 41.13,32.37 41.4,32.64 41.4,33.91 40.89,34.42 40.89,35.81 39.88,36.83 37.85,36.83 34.8,39.88 32.38,39.88 30.99,41.27 30.23,41.27 28.19,43.31 26.16,43.31 25.78,43.69 R4.1
  Top 1.016: R4.1 GPIO.13
A5
  Top 0.254: R26.1 22.1,42.67 22.1,40.51 23.24,39.37 26.54,39.37 28.32,41.15 29.59,41.15 29.97,40.77 30.73,40.77 32.13,39.37 34.54,39.37 37.59,36.32 39.62,36.32 40.39,35.56 40.39,34.16 40.89,33.66 40.89,32.89 40.63,32.63 U1.23
  Top 1.016: R26.1 GPIO.11
AGND  (via drill 0.6)
  Top 0.254: U1.20 42.13,34.83 C6.2
  Top 0.508: R22.2 40.13,39.37 C18.2
  Top 0.762: C6.2 v42.04,36.45
  Top 1.016: v41.66,39.24 C18.2
  Bottom 0.762: v42.04,36.45 42.04,38.86 v41.66,39.24
BUT/LOAD_FW  (via drill 0.6)
  Top 0.254: v31.11,24.38 31.51,24.78 U1.42 | v56.77,18.8 56.26,19.3 54.84,19.3 54.2,18.67 53.98,18.67 C20.1 | 58.42,23.24 62.74,23.24 63.25,22.73 63.25,19.94 62.1,18.8
  Top 0.508: 58.42,23.24 RM1.4.2
  Top 0.762: v60.71,18.8 62.1,18.8 BUT.P$1
  Bottom 0.254: v31.11,24.38 32.77,24.38 40.89,16.26 45.21,16.26 46.86,17.91 55.12,17.91 56.01,18.8 v56.77,18.8
  Bottom 0.508: v56.77,18.8 v60.71,18.8
D0  (via drill 0.6)
  Top 0.254: 14.22,46.74 15.88,46.74 16.76,45.85 R2.2 | U1.60 41.63,18.77 v41.02,18.16
  Top 1.016: GPIO.4 14.22,46.74
  Bottom 0.254: 14.22,46.74 14.22,44.96 16.51,42.67 23.62,42.67 25.4,40.89 25.4,33.78 v41.02,18.16
  Bottom 1.016: 14.22,46.74 GPIO.4
D1  (via drill 0.6)
  Top 0.254: 16.89,46.99 17.14,46.74 18.67,46.74 19.3,46.1 19.3,44.32 R3.2 | U1.61 42.13,18.25 42.16,18.22 v42.16,17.65
  Top 1.016: GPIO.6 15.88,48.01 16.89,46.99
  Bottom 0.254: v42.16,17.65 42.16,18.29 41.27,19.18 40.77,19.18 25.91,34.04 25.91,41.15 23.88,43.18 18.67,43.18 16.76,45.09 16.76,46.23
  Bottom 0.762: 16.76,46.23 15.49,47.5
  Bottom 1.016: 15.49,47.5 GPIO.6
D2  (via drill 0.6)
  Top 0.254: v43.43,17.65 42.63,18.46 U1.62
  Bottom 0.254: 19.3,46.74 19.3,44.96 20.57,43.69 24.13,43.69 26.42,41.4 26.42,34.29 41.02,19.68 41.53,19.68 43.43,17.78 v43.43,17.65
  Bottom 1.016: 19.3,46.74 19.3,46.99 18.29,48.01 GPIO.8
D3  (via drill 0.6)
  Top 0.254: U1.63 43.13,18.72 43.31,18.54 44.58,18.54 v44.83,18.29
  Bottom 0.254: v44.83,18.29 42.67,20.45 41.02,20.45 26.92,34.54 26.92,41.66 24.38,44.2 22.35,44.2 21.84,44.7 21.84,46.74
  Bottom 1.016: 21.84,46.74 GPIO.10
D4  (via drill 0.6)
  Top 0.254: v44.83,19.58 U1.64
  Bottom 0.254: v44.83,19.58 43.45,20.95 41.27,20.95 27.43,34.8 27.43,41.91 24.38,44.96 24.38,46.74
  Bottom 1.016: 24.38,46.74 GPIO.12
D5  (via drill 0.6)
  Top 0.254: v46.23,20.7 46.23,21.78 U1.1
  Bottom 0.254: v46.23,20.7 45.47,21.46 41.53,21.46 27.94,35.05 27.94,42.16 26.92,43.18 26.92,46.74
  Bottom 1.016: 26.92,46.74 GPIO.14
D6  (via drill 0.6)
  Top 0.254: v47.24,21.46 47.24,21.84 46.81,22.28 U1.2
  Bottom 0.254: v47.24,21.46 46.61,22.1 42.29,22.1 31.5,32.89 31.5,42.29 32.13,42.93 32.13,43.81 31.62,44.32 30.23,44.32 29.46,45.09 29.46,46.74
  Bottom 1.016: 29.46,46.74 GPIO.16
D7  (via drill 0.6)
  Top 0.254: U1.3 43.52,22.78 v42.93,23.37
  Bottom 0.254: v42.93,23.37 41.78,23.37 32,33.15 32,42.04 32.64,42.67 32.64,44.2 32,44.83 32,46.74
  Bottom 1.016: 32,46.74 GPIO.18
D8/UEXT_#CS/VIDEO_SEL  (via drill 0.6)
  Top 0.254: v39.5,30.1 39.75,30.1 40.13,30.48 U1.24 | R1.1 59.18,8.13 59.18,20.57 | 60.96,20.7 60.83,20.57 59.18,20.57 | 59.18,20.57 58.8,20.57 57.91,21.46 57.91,21.97 57.15,22.73 55.5,22.73 v55.12,22.35 54.86,22.1 54.86,20.04 54.13,19.3 52.7,19.3 R13.1
  Top 1.016: 60.96,20.7 61.98,21.72 UEXT.10
  Bottom 0.254: 34.54,46.74 34.54,43.56 34.92,43.18 34.92,33.66 37.59,30.99 38.61,30.99 v39.5,30.1 45.72,23.88 53.59,23.88 v55.12,22.35
  Bottom 1.016: 34.54,46.74 GPIO.20
D9/LED2/VGA_VSYNC  (via drill 0.6)
  Top 0.254: v36.32,34.92 36.32,34.42 36.7,34.04 37.72,34.04 38.63,33.13 U1.27
  Top 0.508: v5.84,45.21 5.84,45.59 D9_E.1 | 21.6,3.67 10.55,3.67 7.87,6.35 v7.87,7.11
  Top 1.016: v6.22,41.4 R10.2 | 21.6,3.67 VGA_DB15-F.14
  Bottom 0.254: v36.32,34.92 35.94,35.31 35.94,42.67 37.08,43.81 37.08,49.4 36.2,50.29
  Bottom 0.508: 6.22,45.21 v6.22,41.4 | v5.84,45.21 6.22,45.21 | 6.22,45.21 6.22,48.26 8.76,50.8 35.69,50.8 36.2,50.29 | v7.87,7.11 5.71,9.27 2.29,9.27 1.02,10.54
  Bottom 1.016: 1.02,44.7 3.56,44.7 4.06,45.21 v5.84,45.21
  Bottom 1.27: 1.02,10.54 1.02,44.7
D10/#SS  (via drill 0.6)
  Top 0.254: R27.1 21.59,42.67 v21.59,39.75 | U1.45 32.7,23.28 30.76,21.34 29.34,21.34 28.83,21.84 v28.83,23.37
  Top 1.016: R27.1 GPIO.9
  Bottom 0.254: v28.83,23.37 28.83,28.07 23.88,33.02 23.88,37.47 v21.59,39.75
D11/SD_MOSI  (via drill 0.6)
  Top 0.254: v35.43,14.22 37.13,15.92 U1.51
  Top 0.508: 17.91,29.34 19.18,30.61 R6.1
  Top 0.762: SD/MMC.3 13.43,28.55 14.22,29.34 v16.38,29.34 17.91,29.34
  Top 1.016: 17.91,44.96 17.91,45.34 GPIO.7
  Bottom 0.254: v16.38,29.34 17.27,28.45 19.18,28.45 33.4,14.22 v35.43,14.22 37.21,14.22 38.48,12.95 41.66,12.95 43.31,11.3 60.07,11.3 63.25,14.48 63.25,23.24 62.74,23.75
  Bottom 0.508: v16.38,29.34 16.13,29.59 16.13,40.51 11.68,44.96 11.68,48.64 12.32,49.28 16,49.28 16.76,48.51 16.76,47.5 18.03,46.23
  Bottom 1.016: 62.74,23.75 UEXT.8 | 18.03,46.23 GPIO.7
D12/SD_MISO  (via drill 0.6)
  Top 0.254: v35.94,16.64 36.63,17.32 U1.50 | v18.29,39.12 17.91,39.12 15.88,41.15 15.88,42.04 15.49,42.42
  Top 0.508: 6.3,32.95 7.62,31.62 17.91,31.62 v18.29,32 19.18,32 R7.1
  Top 0.762: SD/MMC.7 6.3,32.95
  Top 1.016: 15.49,42.42 GPIO.5
  Bottom 0.254: 18.29,30.86 32.51,16.64 v35.94,16.64 36.32,16.64 38.99,13.97 42.16,13.97 43.81,12.32 59.31,12.32 61.72,14.73 61.72,19.05 61.09,19.68 59.69,19.68 58.17,21.21 58.17,23.24 58.55,23.62
  Bottom 0.508: 18.29,30.86 v18.29,32 v18.29,39.12
  Bottom 1.016: 58.55,23.62 UEXT.7
D13/SD_CLK  (via drill 0.6)
  Top 0.254: v35.43,15.49 35.05,15.88 35.05,17.4 36.13,18.48 U1.49
  Top 0.508: v17.14,30.48 6.99,30.48 6.72,30.75
  Top 0.762: SD/MMC.5 6.72,30.75
  Bottom 0.254: 18.41,29.21 19.18,29.21 32.89,15.49 v35.43,15.49 36.7,15.49 38.73,13.46 41.91,13.46 43.56,11.81 59.69,11.81 62.23,14.35 62.23,19.56 61.09,20.7 60.71,20.7 60.33,21.08
  Bottom 0.762: GPIO.3 12.95,44.96 17.14,40.77 v17.14,30.48 18.41,29.21
  Bottom 1.016: 60.33,21.08 UEXT.9
D+
  Top 0.254: USB.D+ 8.51,14.61 9.53,13.59 33.91,13.59 34.04,13.72 34.04,17.91 35.05,18.92 35.05,27.05 34.83,27.28 U1.37
D-  (via drill 0.6)
  Top 0.254: U1.36 35.09,27.78 35.56,27.3 35.56,18.67 34.54,17.65 34.54,13.46 34.16,13.08 14.35,13.08 v13.97,12.7
  Top 0.508: USB.D- 8.6,15.4 9.78,14.22 12.95,14.22 v13.21,14.48
  Bottom 0.762: v13.21,14.48 13.21,13.46 v13.97,12.7
GND  (via drill 0.6)
  Top 0.254: 39.63,33.91 U1.25 | 47.7,25.78 U1.9 | 29.84,24.38 30.74,25.28 U1.41 | 25.02,28.45 24.89,28.57 24.89,34.29
  Top 0.508: 55.37,7.02 C17.2 55.63,12.7 56.26,12.7 v56.77,13.21 | C4.2 39.63,34.67 39.63,33.91 40.01,33.53 v40.01,33.27 | C13.2 C11.1 C15.1 11.3,20.32 | 11.3,20.32 12.32,20.32 12.7,20.7 13.97,20.7 | USB.GND 8.71,13.01 v8.76,12.95 | v4.7,21.59 10.16,21.59 11.05,20.7 11.05,20.32 11.3,20.32 | 22.35,18.16 22.35,22.2 C22.- 21.08,22 21.08,21.46 20.57,20.95 14.22,20.95 13.97,20.7 | C12.1 C3.2 28.07,32.51 27.18,31.62 v27.18,28.45 | 22.35,18.16 Q2.GND | 22.35,18.16 22.35,16.51 23.37,15.49 25.15,15.49 25.27,15.62 C9.1 | 47.7,25.78 C5.2 48.13,25.86 48.59,25.86 48.9,26.16 48.9,27.69 49.28,28.07 49.66,28.07 R19.1 | v50.04,14.73 50.55,15.24 52.32,15.24 C20.2 R20.1 | v27.69,24.38 29.84,24.38 | D1.C 32.56,18.08 32,17.53 32,16.51 30.61,15.11 | 13.97,20.7 R21.2 | v27.69,26.54 26.92,26.54 25.02,28.45
  Top 0.762: 29.08,26.54 C7.1 | v27.69,26.54 29.08,26.54 | 29.08,26.54 C8.1 | v44.83,13.34 43.56,13.34 | 43.56,13.34 C1.2 | 43.56,13.34 43.56,14.35 C2.2 | v39.12,15.11 39.12,13.08 37.59,11.56 36.63,11.56 | 28.19,9.4 28.78,9.98 29.01,9.98 30.58,11.56 36.63,11.56 | v22.35,29.08 R5.2 | GPIO.2 10.41,48.26 11.68,49.53 39.37,49.53 | 56.52,38.1 60.2,38.1 61.09,37.21 PWR_LED.C | 25.27,15.62 25.53,15.62 26.04,15.11 30.61,15.11 | 36.63,11.56 VGA_DB15-F.GND2
  Top 0.813: SD/MMC.6 2.79,31.84 v2.79,31.88
  Top 1.016: PWR_J.- 51.36,48.56 50.93,48.13 50.95,48.11 50.09,47.24 X1.2 | VGA_DB15-F.7 27.56,8.76 28.19,9.4 | 55.37,7.02 PS2_KEYBOARD.3 | C9.1 C10.1 | 40.89,46.99 GPIO.25 | 40.89,46.99 GPIO.26 39.37,49.53 | C16.1 R30.1 11.94,43.94 GPIO.1 8.31,45.47 7.37,44.53 LED2.C v5.09,43.56 LED1.C | PWR_LED.C 61.85,36.58 62.99,35.43 62.99,33.15 UEXT.2 | C21.2 v51.44,28.32 R19.1 | v37.21,41.15 R22.1 | v50.29,34.67 v48.01,34.67 C23.2 46.61,34.54 46.35,34.29 C14.2 | 40.89,46.99 45.47,46.99 PWR_J.-- 49.19,46.99 X1.2 | X1.2 | 55.75,38.99 55.75,38.86 56.52,38.1 C19.2 | v55.24,38.99 55.75,38.99 | 55.75,38.99 R15.1 | D1.C 33.02,18.46 v33.02,19.68
  Bottom 0.508: v5.09,43.56 ICSP.3 5.09,31.88 | 24.14,9.65 23.76,10.03 21.73,10.03 21.09,9.4
  Bottom 0.762: 5.09,21.59 5.09,18.79 6.22,17.65 6.22,15.49 v8.76,12.95 9.65,12.95 11.63,10.97 VGA_DB15-F.GND1 8.71,5.84 6.1,5.84 AUDIO.2 | 5.09,21.59 v4.7,21.59 | 44.83,14.73 39.5,14.73 v39.12,15.11 34.54,19.68 v33.02,19.68 30.61,19.68 27.69,22.61 v27.69,24.38 v27.69,26.54 27.69,27.94 v27.18,28.45 26.54,29.08 v22.35,29.08 | v56.77,13.21 55.24,14.73 v50.04,14.73 44.83,14.73 | 44.83,14.73 v44.83,13.34 | 5.09,21.59 5.09,31.88 v2.79,31.88
  Bottom 1.016: VGA_DB15-F.7 VGA_DB15-F.8 24.14,9.65 | GPIO.1 GPIO.2 | 21.09,9.4 VGA_DB15-F.10 | 40.01,34.67 v48.01,34.67 | GPIO.25 38.61,43.18 38.61,41.15 | v51.44,28.32 50.29,29.46 v50.29,34.67 50.29,37.59 51.69,38.99 v55.24,38.99 | 40.01,34.67 38.61,36.07 38.61,41.15 | 40.01,34.67 v40.01,33.27 | 38.61,41.15 v37.21,41.15
  other vias: 15.24,1.27 22.86,1.27 30.48,1.27 38.1,1.27 3.17,21.59 13.21,21.97 34.04,42.04
  pour Bottom (isolate 0.406, rank 2): -5.08,55.88 69.85,55.88 69.85,-5.08 -5.08,-5.08
  pour Top (isolate 0.406, rank 2): -2.54,53.34 67.31,53.34 67.31,-2.54 -2.54,-2.54 -2.41,20.57 9.65,20.57 9.65,35.69 -2.54,35.69
KBD_CLK  (via drill 0.6)
  Top 0.254: U1.54 38.63,16.87 40.01,15.49 40.01,10.41 v40.13,10.29
  Top 1.016: PS2_KEYBOARD.5 54.19,9.31 53.59,9.91 R23.2
  Bottom 0.254: v40.13,10.29 42.04,10.29 42.82,9.5 53.37,9.5 53.85,9.02
  Bottom 1.016: 53.85,9.02 54.19,8.68 PS2_KEYBOARD.5
KBD_DATA  (via drill 0.6)
  Top 0.254: 50.93,7.1 50.93,9.78 | U1.55 39.13,17.13 40.51,15.75 40.51,11.56 41.02,11.05 41.02,8.38 v42.8,6.6
  Top 0.762: 50.93,9.78 50.93,11.68 R25.2
  Top 1.016: PS2_KEYBOARD.1 50.93,7.1
  Bottom 0.254: v42.8,6.6 44.32,6.6 44.83,7.11 50.92,7.11
  Bottom 1.016: 50.92,7.11 PS2_KEYBOARD.1
LED1/ID  (via drill 0.6)
  Top 0.254: U1.30 37.13,32.34 36.96,32.51 35.81,32.51 32,36.32 30.61,36.32 29.21,37.72 28.19,37.72 27.81,37.34 19.68,37.34 19.3,37.72 16.51,37.72 16.13,38.1 v15.11,38.1 | R9.2 4.45,40.51 10.54,40.51 10.79,40.77 12.83,40.77 C16.2
  Top 0.508: v15.11,38.1 R29.1 | C16.2 13.97,41.4 14.48,41.4 15.11,40.77 v15.11,40.01
  Top 0.762: C16.2 R30.2
  Bottom 0.508: v15.11,40.01 v15.11,38.1
MCIDAT1
  Top 0.508: R11.1 19.18,33.78 18.29,33.78 17.27,34.8 14.48,34.8 14.22,34.54 14.22,33.91 13.72,33.4 7.24,33.4 6.59,34.05 SD/MMC.8
MCIDAT2
  Top 0.406: 17.14,24.51 18.03,25.4 18.03,26.67 18.67,27.3 19.18,27.3 R31.1
  Top 0.762: SD/MMC.1 12.52,26.34 14.35,24.51 17.14,24.51
N$1  (via drill 0.6)
  Top 0.508: D9_E.2 8.13,48.01 8.76,48.64 v8.76,49.02
  Bottom 0.508: v8.76,49.02 9.78,50.04 35.05,50.04 35.81,49.28
  Bottom 1.016: 35.81,49.28 GPIO.22
N$2
  Top 0.254: U1.48 33.33,21.78 31.37,19.81 31.37,18.03 30.23,16.89 Q2.1 27.69,16.89 C9.2
N$3  (via drill 0.6)
  Top 0.254: U1.46 32.91,22.78 30.96,20.83 24.51,20.83 24.26,20.57 24.26,20.19 v23.75,19.68
  Top 0.508: R18.2 20.32,19.81 20.95,19.81 v21.34,20.19
  Bottom 0.61: v23.75,19.68 22.61,19.68 22.1,20.19 v21.34,20.19
N$4
  Top 0.254: 2.59,39.42 3.17,40.01 11.81,40.01 R8.1
  Top 0.762: ICSP.1 2.59,39.42
N$5
  Top 0.406: R10.1 LED2.A
N$6  (via drill 0.6)
  Top 0.508: 17.02,19.56 R21.1 | v17.02,18.8 17.02,19.56 | 17.02,19.56 R18.1
  Bottom 0.508: v17.02,18.8 16.89,18.8 14.35,16.26 14.35,13.97 15.24,13.08 15.24,7.11 13.08,4.95 4.7,4.95 3.68,5.97 3.43,5.97 AUDIO.1
N$8
  Top 0.508: R24.2 PWR_LED.A
N$11
  Top 0.762: RST.2 49.91,24.22 R19.2
N$12  (via drill 0.6)
  Top 0.508: v56.64,16.51 56.64,17.4 56.01,18.03 55.37,18.03 R20.2
  Top 1.016: v60.07,16.13 60.07,10.29 BUT.P$2
  Bottom 0.762: v60.07,16.13 57.28,16.13 57.02,16.13 v56.64,16.51
N$13
  Bottom 1.016: 54.44,43.69 PWR_J.+ | 54.44,43.69 X1.1 | 54.44,43.69 54.44,42.97 57.78,39.62 EXT/USB.1
N$17
  Top 0.254: Q1.2 26.16,31.5 26.16,28.19 26.8,27.56 27.81,27.56 28.07,27.81 28.07,28.7 28.32,28.96 30.23,28.96 30.48,28.7 30.48,28.32 C7.2 32.52,26.28 U1.39
N$18  (via drill 0.6)
  Top 0.254: U1.6 46.59,24.28 46.86,24 46.86,23.37 48.13,22.1 48.13,12.7 43.94,8.51 v43.05,8.51
  Top 0.762: v17.14,15.88 18.03,15.88 R16.1
  Bottom 0.254: v43.05,8.51 42.55,8 41.91,8 38.99,5.08 34.67,5.08 32.89,6.86 32.89,10.79 27.81,15.88 v17.14,15.88
N$19
  Top 0.254: Q1.1 25.78,25.27 29.97,25.27 C8.2 31.24,25.78 U1.40
N$23
  Top 0.406: R9.1 LED1.A
N$24  (via drill 0.6)
  Top 0.254: U1.8 46.6,25.28 47.5,24.38 47.5,23.5 48.64,22.35 48.64,12.32 v43.81,7.49
  Top 0.813: v15.37,14.48 15.11,14.48 14.07,15.52 14.07,16.03 R12.1
  Bottom 0.254: v15.37,14.48 17.14,14.48 18.03,15.37 27.56,15.37 32.38,10.54 32.38,6.6 34.42,4.57 39.24,4.57 42.16,7.49 v43.81,7.49
N$28
  Top 0.254: U1.47 33.12,22.28 30.79,19.94 30.61,19.94 Q2.2 29.59,19.94 C10.2
N$39
  Top 1.016: R14.1 53.87,40.64 | 53.87,40.64 R15.2 | 53.87,40.64 VR(3.3V).1
N$86
  Top 0.762: 57.4,8.89 57.99,9.47 57.99,13.64 57.28,14.35 55.5,14.35 C17.1
  Top 1.016: 57.4,8.89 57.4,3.24 PS2_KEYBOARD.SHIELD3 56.83,2.67 51.33,2.67 PS2_KEYBOARD.SHIELD2 45.49,2.26 44.7,3.05 44.7,3.06 PS2_KEYBOARD.SHIELD1
N$116
  Top 0.508: 3.18,25.14 12.2,25.14 13.97,23.37 19.05,23.37 | 19.05,23.37 19.05,22.96 C22.+ | 19.05,23.37 19.05,25.53 L1.2
  Top 0.762: SD/MMC.4 3.1,29.64 2.54,29.08 2.54,25.78 3.18,25.14
PGEC1  (via drill 0.6)
  Top 0.254: U1.15 42.75,28.78 41.15,27.18 37.34,27.18 34.92,29.59 34.92,31.88 31.5,35.31 23.5,35.31 23.24,35.05 18.41,35.05 18.03,35.43 9.4,35.43
  Top 0.508: v12.7,17.91 R28.2
  Top 0.762: ICSP.5 7.59,37.24 9.4,35.43
  Bottom 0.762: 7.21,19.21 7.21,18.95 8.26,17.91 v12.7,17.91
  Bottom 0.813: 7.21,36.16 7.59,36.55 ICSP.5
  Bottom 1.524: 7.21,19.21 7.21,36.16
PGED1
  Top 0.254: 6.34,39 6.84,39.5 9.4,39.5 10.03,38.86 10.03,37.21 11.3,35.94 18.29,35.94 18.67,35.56 22.99,35.56 23.24,35.81 31.75,35.81 35.43,32.13 35.43,29.84 37.59,27.69 40.89,27.69 42.48,29.28 U1.16
  Top 0.762: ICSP.4 6.34,39
RESET  (via drill 0.6)
  Top 0.254: v43.42,24.78 U1.7 | R8.2 14.48,39.12 16.13,39.12 17.02,38.23 19.56,38.23 19.94,37.85 27.56,37.85 27.94,38.23 29.46,38.23 30.73,36.96 v33.4,36.96
  Top 0.508: 54.61,26.54 54.61,24.42 RST.1 53.85,23.66 v53.85,22.35 53.85,21.16 D2.A | 54.61,26.54 C21.1 | 54.61,26.54 54.61,28.19 55.12,28.7 56.39,28.7 57.28,27.81 57.28,26.92 RM1.1.2
  Bottom 0.254: v33.4,36.96 33.15,36.7 33.15,33.66 38.35,28.45 39.75,28.45 v43.42,24.78 45.09,23.11 47.62,23.11 49.28,21.46 52.96,21.46 v53.85,22.35
SCL1  (via drill 0.6)
  Top 0.254: U1.44 32.49,23.78 30.94,22.23 v29.72,22.23 | v60.58,17.4 61.09,16.89 61.09,15.37 61.34,15.11 63.12,15.11 63.88,15.88 63.88,27.3 62.87,28.32 60.87,28.32 | 58.8,26.42 58.17,25.78 58.04,25.78
  Top 0.508: v23.11,40.77 R26.2 | UEXT.5 58.8,26.42 | 58.04,25.78 RM1.2.2
  Top 1.016: UEXT.5 59.47,27.05 59.47,27.69 60.23,27.69 60.87,28.32
  Bottom 0.254: v23.11,40.77 23.11,39.12 24.38,37.85 24.38,33.27 29.72,27.94 v29.72,22.23 34.16,22.23 40.64,15.75 45.47,15.75 47.12,17.4 v60.58,17.4
SD_#CS  (via drill 0.6)
  Top 0.254: v36.96,13.21 38.13,14.38 U1.53
  Top 0.406: v16.89,25.78 17.27,26.16 17.27,27.43 18.67,28.83
  Top 0.508: SD/MMC.2 12.81,27.45 14.73,25.53 16.64,25.53 v16.89,25.78 | 18.67,28.83 19.18,28.83 R5.1
  Bottom 0.254: v36.96,13.21 33.66,13.21 21.08,25.78 18.16,25.78
  Bottom 0.762: v16.89,25.78 18.16,25.78
SDA1  (via drill 0.6)
  Top 0.254: v30.61,23.24 31.24,23.24 32.28,24.28 U1.43 | 60.71,25.78 58.93,25.78 58.17,25.02 58.04,25.02
  Top 0.508: v24.51,40.26 25.4,41.15 25.4,41.91 R4.2 | 58.04,25.02 RM1.3.2
  Top 1.016: UEXT.6 60.71,25.78
  Bottom 0.254: 61.09,26.16 60.71,25.78 58.67,25.78 57.53,24.64 57.53,21.08 54.86,18.41 46.61,18.41 44.96,16.76 41.15,16.76 32.38,25.53 30.23,25.53 | v24.51,40.26 24.51,38.61 24.89,38.23 24.89,33.53 30.23,28.19 30.23,25.53 | v30.61,23.24 30.23,23.62 30.23,25.53
  Bottom 1.016: 61.09,26.16 UEXT.6
U2RX
  Top 0.254: U1.31 36.63,30.17 38.1,28.7 40.39,28.7 42.04,30.35 46.99,30.35 47.5,29.84 57.15,29.84 58.17,30.86 60.71,30.86 60.96,30.61
  Top 1.016: 60.96,30.61 UEXT.4
U2TX
  Top 0.254: U1.32 36.13,29.91 37.85,28.19 40.64,28.19 42.29,29.84 46.74,29.84 47.24,29.34 58.29,29.34 58.55,29.59
  Top 1.016: 58.55,29.59 UEXT.3
U5RX  (via drill 0.6)
  Top 0.254: R2.1 20.32,38.35 27.3,38.35 27.69,38.73 29.72,38.73 30.61,37.85 33.78,37.85 34.42,37.21 34.42,36.07 v34.04,35.69 | U1.21 41.63,30.71 40.13,29.21 38.99,29.21 v38.23,29.97
  Bottom 0.254: v34.04,35.69 34.04,33.66 37.72,29.97 v38.23,29.97
U5TX
  Top 0.254: R3.1 18.67,40.77 20.57,38.86 27.05,38.86 27.43,39.24 29.97,39.24 30.86,38.35 34.04,38.35 34.92,37.47 34.92,34.42 36.32,33.02 37.21,33.02 37.63,32.6 U1.29
USB_SHIELD
  Top 1.016: USB.GND4 USB.GND3 USB.GND1 USB.GND2 6.92,19.81 C15.2
VCC  (via drill 0.6)
  Top 0.254: U1.26 39.13,33.39 C4.1 37.21,35.31 37.21,35.94 34.29,38.86 31.88,38.86 30.48,40.26 v28.83,40.26 | 32,28.28 U1.35 | U1.10 46.77,26.28 C5.1 | C12.2 32,29.72 32,28.28 | 32,28.28 32,27.56 32.79,26.78 U1.38 | U1.57 40.13,17.78 40.89,17.02
  Top 0.406: v51.18,26.67 51.18,26.16 50.8,25.78 50.8,21.51 D2.C
  Top 0.508: C12.2 C3.1 30.61,32.77 30.61,33.78 v30.48,33.91 | v46.86,19.3 46.86,18.29 45.09,16.51 41.4,16.51 40.89,17.02 | 3.84,36.48 6.83,36.48 8.76,34.54 v13.21,34.54 | R31.2 22.35,27.56 23.37,28.57 23.37,29.59 22.35,30.61 R6.2 | RM1.4.1 55.5,24.13 55.5,25.02 | 55.5,25.02 RM1.3.1 | 55.5,25.78 RM1.2.1 | 55.5,25.78 55.5,25.02 | RM1.1.1 55.5,26.67 55.5,26.54 | 55.5,26.54 55.5,25.78 | v55.63,27.69 55.5,27.56 55.5,26.54
  Top 0.762: 44.83,39.24 44.83,38.48 C23.1 | 3.84,36.48 ICSP.2 | R29.2 11.94,37.34 12.45,36.83 v13.59,36.83 18.67,36.83 19.05,36.45 v22.35,36.45 22.48,36.58 28.57,36.58 v28.83,36.83 | v20.45,40.39 20.45,41.78 R27.2 | 50.42,19.3 v49.91,19.3 | 50.42,19.3 50.42,20.52 D2.C | 50.42,19.3 50.42,17.27 51.18,16.51 R13.2 | 44.83,39.24 L2.1 | 44.83,39.24 v44.83,42.67 39.37,42.67 38.23,43.81 31.75,43.81 v31.24,43.31 | v47.88,28.45 C5.1 | 21.21,33.02 R7.2 R6.2 | 21.21,33.02 R11.2 | L1.1 21.21,25.91 R31.2 | v22.35,33.02 21.21,33.02 | R14.2 50.55,40.51 50.55,40.13 51.56,39.12 VR(3.3V).2 | 51.56,32.26 57.91,32.26 | 57.91,32.26 59.31,32.26 UEXT.1 | v48.9,30.73 49.4,31.24 49.4,32.26 | 57.91,32.26 57.91,36.07 58.29,36.45 58.93,36.45 R24.1
  Top 1.016: C23.1 47.88,36.7 48.51,36.07 v49.02,36.07 51.31,36.07 51.56,36.32 VR(3.3V).2 | VR(3.3V).4 51.56,32.26 49.4,32.26 C14.1
  Bottom 0.508: v13.21,34.54 13.59,34.92 v13.59,36.83
  Bottom 0.762: v20.45,40.39 20.45,38.35 v22.35,36.45 v22.35,33.02 | v49.91,19.3 v46.86,19.3 | 29.59,36.83 29.59,34.8 v30.48,33.91 | v28.83,36.83 29.59,36.83 | 29.59,36.83 29.59,40.26 | v49.02,36.07 49.15,35.94 49.15,30.73 | 49.15,30.73 v48.9,30.73 | 49.15,30.73 49.15,28.45 | 49.15,28.45 50.93,26.67 v51.18,26.67 54.61,26.67 v55.63,27.69 | 49.15,28.45 v47.88,28.45 | 29.59,40.26 v28.83,40.26 | 29.59,40.26 29.59,41.66 v31.24,43.31 | 39.75,49.4 43.18,49.4 44.83,47.75 v44.83,42.67
  Bottom 1.016: 39.75,49.4 GPIO.24
  other vias: 53.47,35.81 53.47,34.67 54.61,35.81 54.61,34.67
  pour Top (isolate 0.406): 44.7,42.04 57.15,42.04 57.15,30.23 44.7,30.23
  pour Bottom (isolate 0.406): 45.72,42.04 56.01,42.04 60.45,37.59 60.45,33.53 57.15,30.23 45.72,30.23
VDD  (via drill 0.6)
  Top 0.254: U1.19 42.63,32.59 43.43,33.4 43.43,34.54 C6.1
  Top 0.508: L2.2 43.31,41.15
  Top 0.762: C6.1 43.81,35.94 v43.56,36.2
  Top 1.016: C18.1 v41.78,41.27 L2.2
  Bottom 0.762: v43.56,36.2 43.56,39.5 v41.78,41.27
VGA_GND  (via drill 0.6)
  Top 0.762: v60.83,6.22 R1.2 | VGA_DB15-F.6 33.79,4.57 v40.89,4.57
  Bottom 0.508: 55.12,4.7 54.99,4.57 46.61,4.57 45.85,5.33 43.05,5.33 42.93,5.21
  Bottom 0.762: v60.83,6.22 60.2,5.59 56.01,5.59 55.12,4.7 | 42.93,5.21 42.29,4.57 v40.89,4.57
VGA_HSYNC  (via drill 0.6)
  Top 0.254: 23.89,7.74 23.89,9.39 22.73,10.54 v22.73,12.19 22.99,12.45 34.92,12.45 37.63,15.15 U1.52
  Top 0.508: R12.2 16,15.88 16,15.37 16.89,14.48 19.94,14.48 | 19.94,14.48 R17.1 | v20.45,14.48 19.94,14.48
  Top 1.016: VGA_DB15-F.13 23.89,7.74
  Bottom 0.508: v22.73,12.19 v20.45,14.48
VIDEO  (via drill 0.6)
  Top 0.508: D1.A 32.18,14.22 24.89,14.22 v24.64,14.48 22.35,14.48 20.95,15.88 20.95,17.4 20.7,17.65 20.19,17.65 R17.2
  Top 1.016: R17.2 R16.2
  Bottom 0.406: 24.13,12.95 24.13,14.48 | 26.17,14.48 26.17,12.95 | 27.18,14.48 28.46,13.2
  Bottom 1.016: VGA_DB15-F.3 23.88,11.3 24.13,11.56 24.13,12.95 | 24.13,14.48 v24.64,14.48 26.17,14.48 27.18,14.48 | 26.17,12.95 VGA_DB15-F.2 | 28.46,13.2 VGA_DB15-F.1

### Text on the board
tNames: 5VDC | + | DuinoMite-Mini | Rev.C | VGA | GND
bNames: based on http://geoffg.net/maximite.html
bStop: +5VDC only | DONTRONICS.COM | OLIMEX.COM/DEV | MADE IN BULGARIA | DESIGNED BY: OLIMEX | KENSEGLERDESIGNS.COM | DuinoMite-Mini | B | G | R
213bmp: POLIGONI NA CIFROVOTO ZAHRANVANE I CHARGERA